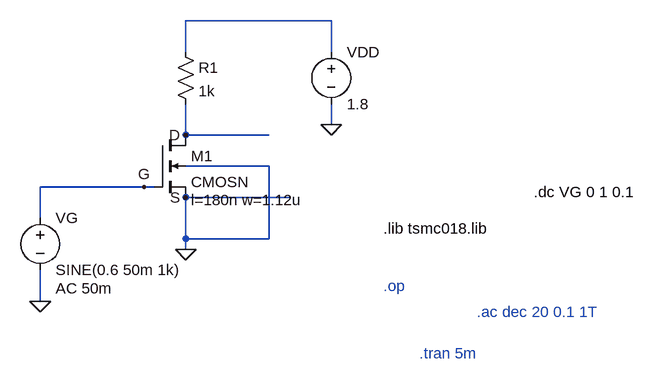
[diagram p0: schematic expt_1_a.asc]
expt_1_a.asc, the LTspice schematic file:
Version 4.1
SHEET 1 1168 680
WIRE 464 -48 240 -48
WIRE 240 0 240 -48
WIRE 464 0 464 -48
WIRE 464 112 464 80
WIRE 240 128 240 80
WIRE 368 128 240 128
WIRE 368 176 240 176
WIRE 176 208 16 208
WIRE 192 208 176 208
WIRE 400 224 240 224
WIRE 16 256 16 208
WIRE 240 288 240 224
WIRE 368 288 368 176
WIRE 368 288 240 288
WIRE 240 304 240 288
WIRE 16 384 16 336
FLAG 240 304 0
FLAG 16 384 0
FLAG 464 112 0
FLAG 240 128 D
FLAG 240 224 S
FLAG 176 208 G
SYMBOL nmos4 192 128 R0
WINDOW 123 56 100 Left 2
SYMATTR Value2 l=180n w=1.12u
SYMATTR InstName M1
SYMATTR Value CMOSN
SYMBOL res 224 -16 R0
SYMATTR InstName R1
SYMATTR Value 1k
SYMATTR SpiceLine tol=5
SYMBOL voltage 464 -16 R0
WINDOW 123 0 0 Left 0
WINDOW 39 0 0 Left 0
SYMATTR InstName VDD
SYMATTR Value 1.8
SYMBOL voltage 16 240 R0
WINDOW 123 24 124 Left 2
WINDOW 39 0 0 Left 0
SYMATTR Value2 AC 50m
SYMATTR InstName VG
SYMATTR Value SINE(0.6 50m 1k)
TEXT 544 272 Left 2 !.lib tsmc018.lib
TEXT 544 360 Left 2 ;.op
TEXT 600 464 Left 2 ;.tran 5m
TEXT 688 400 Left 2 ;.ac dec 20 0.1 1T
TEXT 776 216 Left 2 !.dc VG 0 1 0.1

The netlist it stands for:
* expt_1_a.asc
M1 D G 0 0 CMOSN l=180n w=1.12u
R1 N001 D 1k tol=5
VDD N001 0 1.8
VG G 0 SINE(0.6 50m 1k) AC 50m
.model NMOS NMOS
.model PMOS PMOS
.lib standard.mos
.lib tsmc018.lib
* .op
* .tran 5m
* .ac dec 20 0.1 1T
.dc VG 0 1 0.1
.backanno
.end